# Altium schematic sheet Connectors.SchDoc
size A4
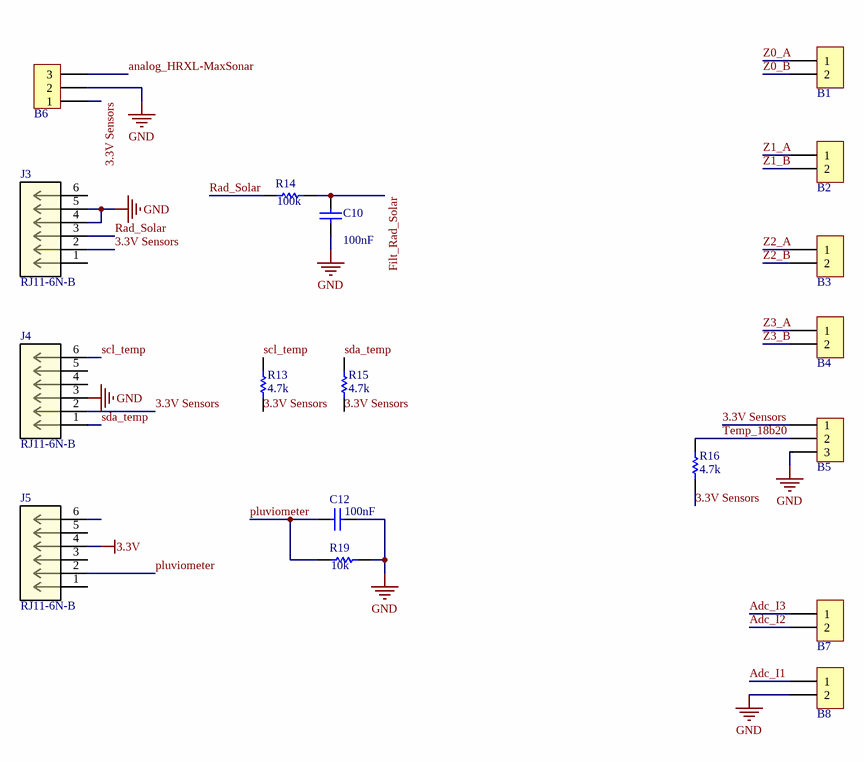
[diagram p0: Connectors.SchDoc]

## Parts
B1  Borne  [BORNE2]  (value not drawn)
B2  Borne  [BORNE2]  (value not drawn)
B3  Borne  [BORNE2]  (value not drawn)
B4  Borne  [BORNE2]  (value not drawn)
B5  Borne 3  [BORNE3]  (value not drawn)
B6  Borne 3  [BORNE3]  (value not drawn)
B7  Borne  [BORNE2]  (value not drawn)
B8  Borne  [BORNE2]  (value not drawn)
C10  value 100nF  [CAP_X7R_0805_AVX]
C12  value 100nF  [CAP_X7R_0805_AVX]
J3  RJ11-6N-B  [CONN_RJ11-6N-B_TEC]
J4  RJ11-6N-B  [CONN_RJ11-6N-B_TEC]
J5  RJ11-6N-B  [CONN_RJ11-6N-B_TEC]
R13  value 4.7k  [6-0805_N]  (hidden comment: Res)
R14  value 100k  [6-0805_N]  (hidden comment: Res)
R15  value 4.7k  [6-0805_N]  (hidden comment: Res)
R16  value 4.7k  [6-0805_N]  (hidden comment: Res)
R19  value 10k  [6-0805_N]  (hidden comment: Res)

## Nets
3.3V: J5.4
GND: B5.3 B6.2 B8.2 C10.2 C12.1 J3.4 J3.5 J4.3 R19.2
3.3V Sensors: B5.1 B6.1 J3.2 J4.2 R13.1 R15.1 R16.1
Adc_I1: B8.1
Adc_I2: B7.2
Adc_I3: B7.1
analog_HRXL-MaxSonar: B6.3
Filt_Rad_Solar: C10.1 R14.2
pluviometer: C12.2 J5.2 R19.1
Rad_Solar: J3.3 R14.1
scl_temp: J4.6 R13.2
sda_temp: J4.1 R15.2
Temp_18b20: B5.2 R16.2
Z0_A: B1.1
Z0_B: B1.2
Z1_A: B2.1
Z1_B: B2.2
Z2_A: B3.1
Z2_B: B3.2
Z3_A: B4.1
Z3_B: B4.2

Not connected (* = marked no-connect by the designer): J3 1 6; J4 4 5; J5 1 3 5 6

## Library data of the parts
B1-B4 B7 B8 = Borne2: Terminal Atornillable 2 salidas
B5 B6 = Borne3: Terminal atornillable 3 salidas
C10 C12 = Capacitor ceramico
J3-J5 = RJ11-6N-B: No Description Available; Vendor: TE Connectivity; Built_By: EMA_Cory; SourceLibrary: TE Connectivity_2020-01-22; Datasheet: https://www.te.com/commerce/DocumentDelivery/DDEController?Action=showdoc&DocId=Customer+Drawing%7FRJ11-6N-B%7F0%7Fpdf%7FEnglish%7FENG_CD_RJ11-6N-B_0.pdf%7F6609212-4; Manufacturer_Part_Number: RJ11-6N-B; Copyright: Copyright (C) 2018 Accelerated Designs. All rights reserved; RefDes: RefDes; Type: DEV
R13-R16 R19 = Resistor 1/4 watt: Resistor empaque ceramico axial de 1/4 de watt; Published: 8-Jun-2000; LatestRevisionDate: 17-Jul-2002; LatestRevisionNote: Re-released for DXP Platform.; PackageReference: AXIAL-0.5; Publisher: Altium Limited